# Altium schematic sheet ESP32.SchDoc
size A4
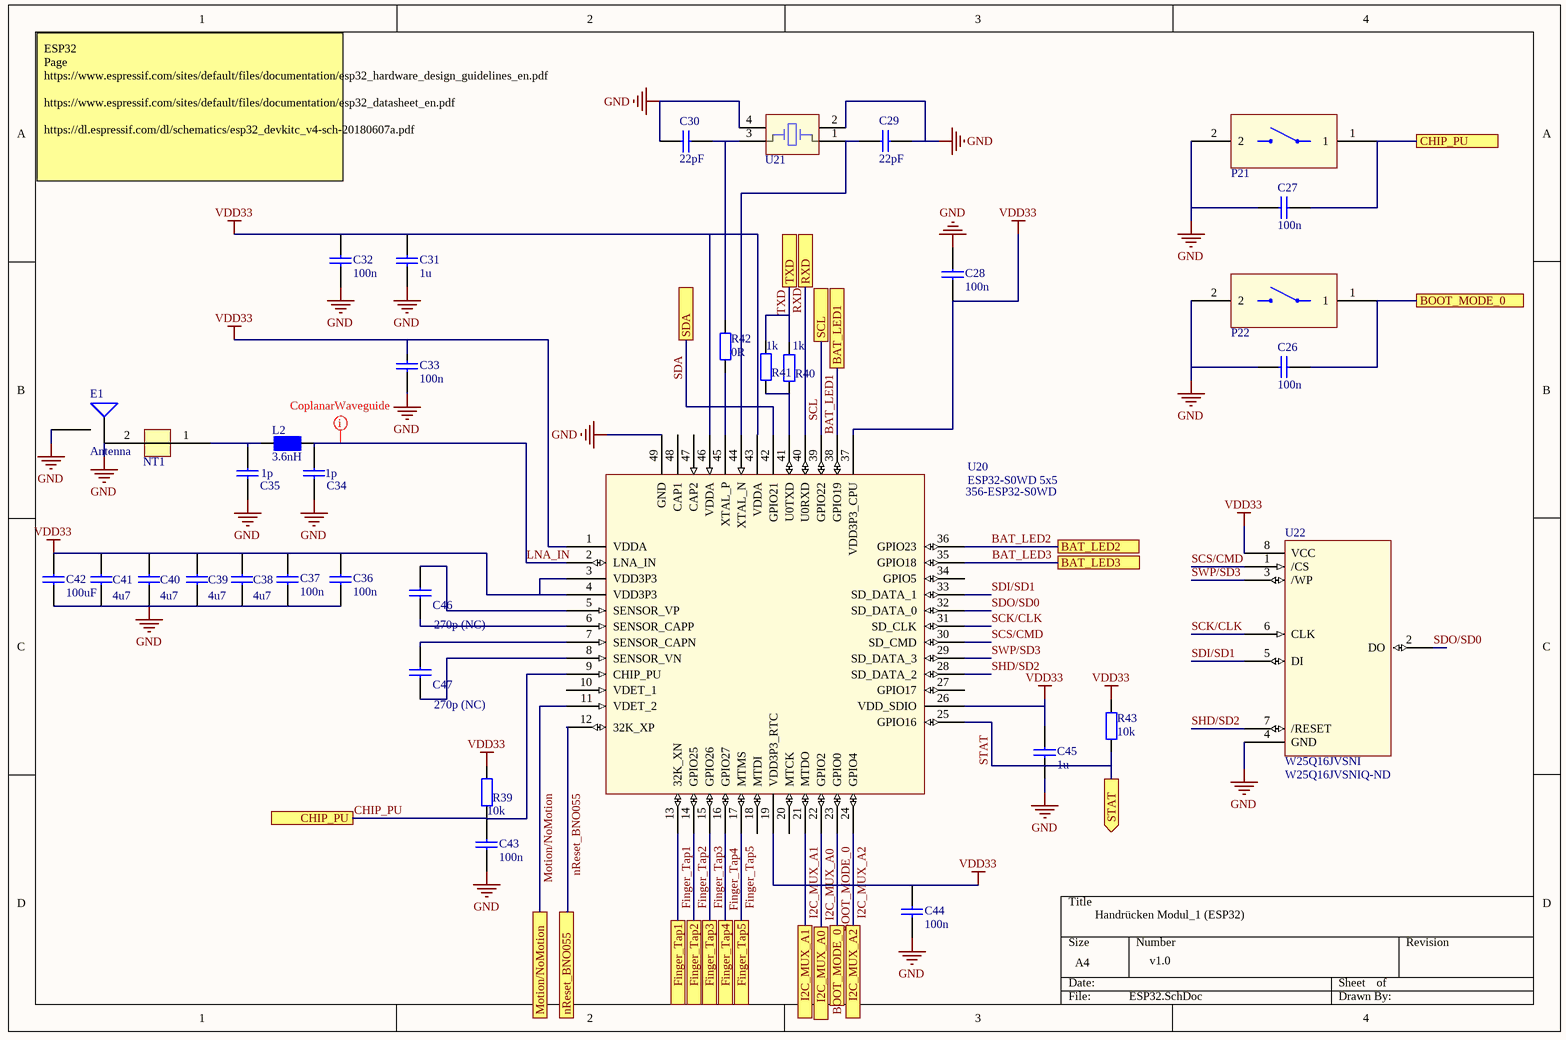
[diagram p0: ESP32.SchDoc]

## Parts
C26  100n  [CAPC1005X55]
C27  100n  [CAPC1005X55]
C28  100n  [CAPC1005X55]
C29  22pF  [CAPC1005X55]
C30  22pF  [CAPC1005X55]
C31  1u  [CAPC1005X55]
C32  100n  [CAPC1005X55]
C33  100n  [CAPC1005X55]
C34  1p  [CAPC2012X100]
C35  1p  [CAPC2012X100]
C36  100n  [CAPC1005X55]
C37  100n  [CAPC1005X55]
C38  4u7  [CAPC1005X55]
C39  4u7  [CAPC1005X55]
C40  4u7  [CAPC1005X55]
C41  4u7  [CAPC1005X55]
C42  100uF  [CAPC3216X180]
C43  100n  [CAPC1005X55]
C44  100n  [CAPC1005X55]
C45  1u  [CAPC1005X55]
C46  270p (NC)  [CAPC1005X55]
C47  270p (NC)  [CAPC1005X55]
E1  Antenna  [Antenna]
L2  3.6nH  [INDC2012X135]
NT1  Net Tie  [NetTie]  (value not drawn)  (net tie, no BOM)
P21  Pushbutton 1 way  [Y35A21120FP]  (value not drawn)
P22  Pushbutton 1 way  [Y35A21120FP]  (value not drawn)
R39  10k  [RESC1005X40]
R40  1k  [RESC1005X40]
R41  1k  [RESC1005X40]
R42  0R  [RESC1005X40]
R43  10k  [RESC1005X40]
U20  ESP32-S0WD 5x5  Supplier Part Number 1: 356-ESP32-S0WD  [ESP32-S0WD 5x5]
U21  40MHz  [OSCCC320X250X70]  (value not drawn)
U22  W25Q16JVSNI  Supplier Part Number 1: W25Q16JVSNIQ-ND  [W25Q16JVSNI]

## Ports
BAT_LED1, BAT_LED2, BAT_LED3, BOOT_MODE_0, CHIP_PU, Finger_Tap1, Finger_Tap2, Finger_Tap3, Finger_Tap4, Finger_Tap5, I2C_MUX_A0, I2C_MUX_A1, I2C_MUX_A2, Motion/NoMotion, nReset_BNO055, RXD, SCL, SDA, STAT (out), TXD

## Nets
GND: C26.2 C27.2 C28.2 C29.2 C30.2 C31.1 C32.1 C33.1 C34.1 C35.1 C36.1 C37.1 C38.1 C39.1 C40.1 C41.1 C42.1 C43.1 C44.1 C45.1 E1.1(input) E1.2(GND) NT1.2 P21.2 P22.2 U20.49(GND) U21.2(GND) U21.4(GND) U22.4(GND)
VDD33: C28.1 C31.2 C32.2 C33.2 C36.2 C37.2 C38.2 C39.2 C40.2 C41.2 C42.2 C44.2 C45.2 R39.2 R43.2 U20.1(VDDA) U20.3(VDD3P3) U20.4(VDD3P3) U20.19(VDD3P3_RTC) U20.26(VDD_SDIO) U20.37(VDD3P3_CPU) U20.43(VDDA) U20.46(VDDA) U22.8(VCC)
BAT_LED1: U20.38(GPIO19) ; port BAT_LED1
BAT_LED2: U20.36(GPIO23) ; port BAT_LED2
BAT_LED3: U20.35(GPIO18) ; port BAT_LED3
BOOT_MODE_0: C26.1 P22.1 U20.23(GPIO0) ; port BOOT_MODE_0
CHIP_PU: C27.1 C43.2 P21.1 R39.1 U20.9(CHIP_PU) ; port CHIP_PU
Finger_Tap1: U20.13(32K_XN) ; port Finger_Tap1
Finger_Tap2: U20.14(GPIO25) ; port Finger_Tap2
Finger_Tap3: U20.15(GPIO26) ; port Finger_Tap3
Finger_Tap4: U20.16(GPIO27) ; port Finger_Tap4
Finger_Tap5: U20.17(MTMS) ; port Finger_Tap5
I2C_MUX_A0: U20.22(GPIO2) ; port I2C_MUX_A0
I2C_MUX_A1: U20.21(MTDO) ; port I2C_MUX_A1
I2C_MUX_A2: U20.24(GPIO4) ; port I2C_MUX_A2
LNA_IN: C34.2 L2.2 U20.2(LNA_IN)
Motion/NoMotion: U20.11(VDET_2) ; port Motion/NoMotion
nReset_BNO055: U20.12(32K_XP) ; port nReset_BNO055
RXD: U20.40(U0RXD) ; port RXD
SCK/CLK: U20.31(SD_CLK) U22.6(CLK)
SCL: U20.39(GPIO22) ; port SCL
SCS/CMD: U20.30(SD_CMD) U22.1(/CS)
SDA: U20.42(GPIO21) ; port SDA
SDI/SD1: U20.33(SD_DATA_1) U22.5(DI)
SDO/SD0: U20.32(SD_DATA_0) U22.2(DO)
SHD/SD2: U20.28(SD_DATA_2) U22.7(/RESET)
STAT: R43.1 U20.25(GPIO16) ; port STAT
SWP/SD3: U20.29(SD_DATA_3) U22.3(/WP)
TXD: R40.2 R41.2 ; port TXD
NetC29_1: C29.1 U20.44(XTAL_N) U21.1(OSC1)
NetC30_1: C30.1 R42.2 U21.3(OSC2)
NetC35_2: C35.2 L2.1 NT1.1
NetC46_1: C46.1 U20.6(SENSOR_CAPP)
NetC46_2: C46.2 U20.5(SENSOR_VP)
NetC47_1: C47.1 U20.8(SENSOR_VN)
NetC47_2: C47.2 U20.7(SENSOR_CAPN)
NetR40_1: R40.1 R41.1 U20.41(U0TXD)
NetR42_1: R42.1 U20.45(XTAL_P)

Not connected (* = marked no-connect by the designer): U20 10(VDET_1) 18(MTDI) 20(MTCK) 27(GPIO17) 34(GPIO5) 47(CAP2) 48(CAP1)

## Layout directives
net class CoplanarWaveguide: LNA_IN

## Notes on the sheet
- ESP32
  Page
  https://www.espressif.com/sites/default/files/documentation/esp32_hardware_design_guidelines_en.pdf
  https://www.espressif.com/sites/default/files/documentation/esp32_datasheet_en.pdf
  https://dl.espressif.com/dl/schematics/esp32_devkitc_v4-sch-20180607a.pdf
- Handrücken Modul_1 (ESP32)
- v1.0

## Library data of the parts
C26-C28 C32 C33 C36 C37 C43 C44 = 1066: Ceramic Chip Capacitor; Manufacturer ID: C0402C104K4RAC; Manufacturer: Kemet; ID: 1066; Type: Standard Ceramic; Voltage: 16V; Characteristic: X7R; Tolerance: ±15%; UBiKS Number: UBiKS-C00001I; Value: 100n; Dielectric: Ceramic; Footprint / Size: C0402; Farnell: 1288252; Digikey: 399-3521-1-ND; Distributor 3: Mouser; Distributor Number 3: 80-C0402C104K4RAUTO; Unit Price: 0; Quantity: 0; ComponentLink1Description: Website; ComponentLink1URL: http://kemet.com/; ComponentLink2Description: Datasheet; ComponentLink2URL: http://www.kemet.com/kemet/web/homepage/kechome.nsf/vapubfiles/F3102_X7R.pdf/$file/F3102_X7R.pdf
C29 C30 = 1085: Ceramic Chip Capacitor; Manufacturer ID: C0402C151J5GAC; Manufacturer: Kemet; ID: 1085; Type: Standard Ceramic; Value: 150p; Voltage: 50V; Characteristic: NP0; Tolerance: ±5%; UBiKS Number: UBiKS-C00020M; Dielectric: Ceramic; Footprint / Size: C0402; Farnell: 1414578; Unit Price: 0; Quantity: 0; ComponentLink1Description: Website; ComponentLink1URL: http://kemet.com/; ComponentLink2Description: Datasheet; ComponentLink2URL: http://www.kemet.com/kemet/web/homepage/kechome.nsf/vapubfiles/F3102_C0G.pdf/$file/F3102_C0G.pdf
C31 C45 = 1079: Ceramic Chip Capacitor; Manufacturer ID: C0402C105K9PAC; Manufacturer: Kemet; ID: 1079; Type: Standard Ceramic; Voltage: 6.3V; Characteristic: X5R; Tolerance: ±10%; UBiKS Number: UBiKS-C00014F; Value: 1u; Dielectric: Ceramic; Footprint / Size: C0402; Farnell: 1288253; Unit Price: 0; Quantity: 0; ComponentLink1Description: Website; ComponentLink1URL: http://kemet.com/; ComponentLink2Description: Datasheet; ComponentLink2URL: http://www.kemet.com/kemet/web/homepage/kechome.nsf/vapubfiles/F3102_X5R.pdf/$file/F3102_X5R.pdf
C34 C35 = 1175: Ceramic Chip Capacitor; Manufacturer ID: C0805C100J5GACTU; Manufacturer: Kemet; ID: 1175; Type: Standard Ceramic; Voltage: 50V; Characteristic: NP0; Tolerance: ±10%; UBiKS Number: UBiKS-C00089S; Value: 1p; Dielectric: Ceramic; Footprint / Size: C0805; Farnell: 1414654; Unit Price: 0; Quantity: 0; ComponentLink1Description: Website; ComponentLink1URL: http://kemet.com/; ComponentLink2Description: Datasheet; ComponentLink2URL: http://www.kemet.com/kemet/web/homepage/kechome.nsf/vapubfiles/F3102_C0G.pdf/$file/F3102_C0G.pdf
C38-C41 = 1253: Manufacturer ID: GRM155R60J475ME47D; Manufacturer: Murata; ID: 1253; Type: Standard Ceramic; Voltage: 6.3V; Dielectric: Ceramic; Characteristic: X5R; Tolerance: ±20%; UBiKS Number: UBiKS-C00140A; Value: 4u7; Footprint / Size: C0402; Farnell: 2426952; ComponentLink1Description: Website; ComponentLink1URL: http://www.murata.com/; ComponentLink2Description: Datasheet; ComponentLink2URL: http://www.farnell.com/datasheets/1769893.pdf
C42 = 1250: Manufacturer ID: GRM31CR60J107ME39L; Manufacturer: Murata; ID: 1250; Type: Standard Ceramic; Value: 100u; Voltage: 6.3V; Dielectric: Ceramic; Characteristic: X5R; Tolerance: ±20%; UBiKS Number: UBiKS-C00137L; Footprint / Size: C1206; Farnell: 1735535; Digikey: 490-4539-1-ND; ComponentLink1Description: Website; ComponentLink1URL: http://www.murata.com/; ComponentLink2Description: Datasheet; ComponentLink2URL: http://search.murata.co.jp/Ceramy/image/img/A01X/G101/ENG/GRM31CR60J107ME39-01.pdf
C46 C47 = 1218: Ceramic Chip Capacitor; Manufacturer ID: C0402C271J5GAC; Manufacturer: Kemet; ID: 1218; Type: Standard Ceramic; Voltage: 50V; Characteristic: NP0; Tolerance: ±5%; UBiKS Number: UBiKS-C00124O; Value: 270p; Dielectric: Ceramic; Footprint / Size: C0402; Farnell: 1414585; Unit Price: 0; Quantity: 0; ComponentLink1Description: Website; ComponentLink1URL: http://kemet.com/; ComponentLink2Description: Datasheet; ComponentLink2URL: http://www.kemet.com/kemet/web/homepage/kechome.nsf/vapubfiles/F3102_C0G.pdf/$file/F3102_C0G.pdf
E1 = Antenna: Antenna (Chip)
L2 = 3012: Chip Ferrit Bead Impedanz 220R; Manufacturer ID: FBMH2012HM221-T; Manufacturer: Taiyo Yuden; ID: 3012; max DC Current: 2A; Resistance: 60mR; Tolerance: ± 25%; UBiKS Number: UBiKS-L00009N; Type: Ferrit Bead; Value: 3.6nH; Footprint / Size: IND0805; Farnell: 1611985; Digikey: 587-1748-1-ND; ComponentLink1Description: Website; ComponentLink1URL: http://www.yuden.co.jp/; ComponentLink2Description: Datasheet; ComponentLink2URL: http://www.yuden.co.jp/us/product/pdf/efbm_e.pdf
NT1 = NetTie
P21 P22 = 7004: Manufacturer ID: Y35A21110FPLFS; Manufacturer: C&K; ID: 7004; UBiKS Number: UBiKS-S00003K; Type: Pushbutton; Distributor 3: RS; Distributor Number 3: 102-377; ComponentLink1Description: Website; ComponentLink1URL: http://www.ck-components.com; ComponentLink2Description: Datasheet; ComponentLink2URL: \\lift\sct-software\altium\sct-svn\0900766b80c5f4ae.pdf
R39 R43 = 2123: Resistor; Manufacturer ID: MC 0.0625W 0402 1% 10K; Manufacturer: Multicomp; ID: 2123; Element Type: Thick Film; Tolerance: ±1%; Power rating: 0.063W; Temperatur coeff: ±100ppm/°C; UBiKS Number: UBiKS-R00007H; Type: Standard; Value: 10k; Footprint / Size: R0402; Farnell: 1358069; ComponentLink1Description: Website; ComponentLink2Description: Datasheet; ComponentLink2URL: http://www.farnell.com/datasheets/318400.pdf
R40 R41 = 2154: Resistor; Manufacturer ID: MC 0.0625W 0402 1% 1K; Manufacturer: Multicomp; ID: 2154; Element Type: Thick Film; Tolerance: ±1%; Power rating: 0.063W; Temperatur coeff: ±100ppm/°C; UBiKS Number: UBiKS-R00038C; Type: Standard; Value: 1k; Footprint / Size: R0402; Farnell: 1358043; ComponentLink1Description: Website; ComponentLink2Description: Datasheet; ComponentLink2URL: http://www.farnell.com/datasheets/318400.pdf
R42 = 2117: Resistor; Manufacturer ID: MC 0.0625W 0402 1% 0R; Manufacturer: Multicomp; ID: 2117; Element Type: Thick Film; Tolerance: ±1%; Power rating: 0.063W; Temperatur coeff: ±200ppm/°C; UBiKS Number: UBiKS-R00001X; Type: Standard; Value: 0R; Footprint / Size: R0402; Farnell: 1357983; ComponentLink1Description: Website; ComponentLink2Description: Datasheet; ComponentLink2URL: http://www.farnell.com/datasheets/318400.pdf
U21 = 9048: Ultra Miniature Ceranic SMD Crystal; Manufacturer ID: ABM8-40.000MHZ-B2-T; Manufacturer: Abracon; ID: 9048; UBiKS Number: UBiKS-X00038I; Type: Crystal; Value: 40MHz; Footprint / Size: XTAL3.2 x 2.5; Digikey: 535-9147-1-ND; Distributor 3: Mouser; Distributor Number 3: 815-ABM8-40-B2-T; ComponentLink1Description: Website; ComponentLink1URL: http://www.abracon.com/; ComponentLink2Description: Datasheet; ComponentLink2URL: http://www.abracon.com/Resonators/abm8.pdf
U20 = ESP32-S0WD 5x5: Supplier 1: Mouser
U22 = W25Q16JVSNI: Supplier 1: Digi-Key